# EasyEDA Pro project ProPrj_red-panda-afm_2025-05-21.epro, board PCB5
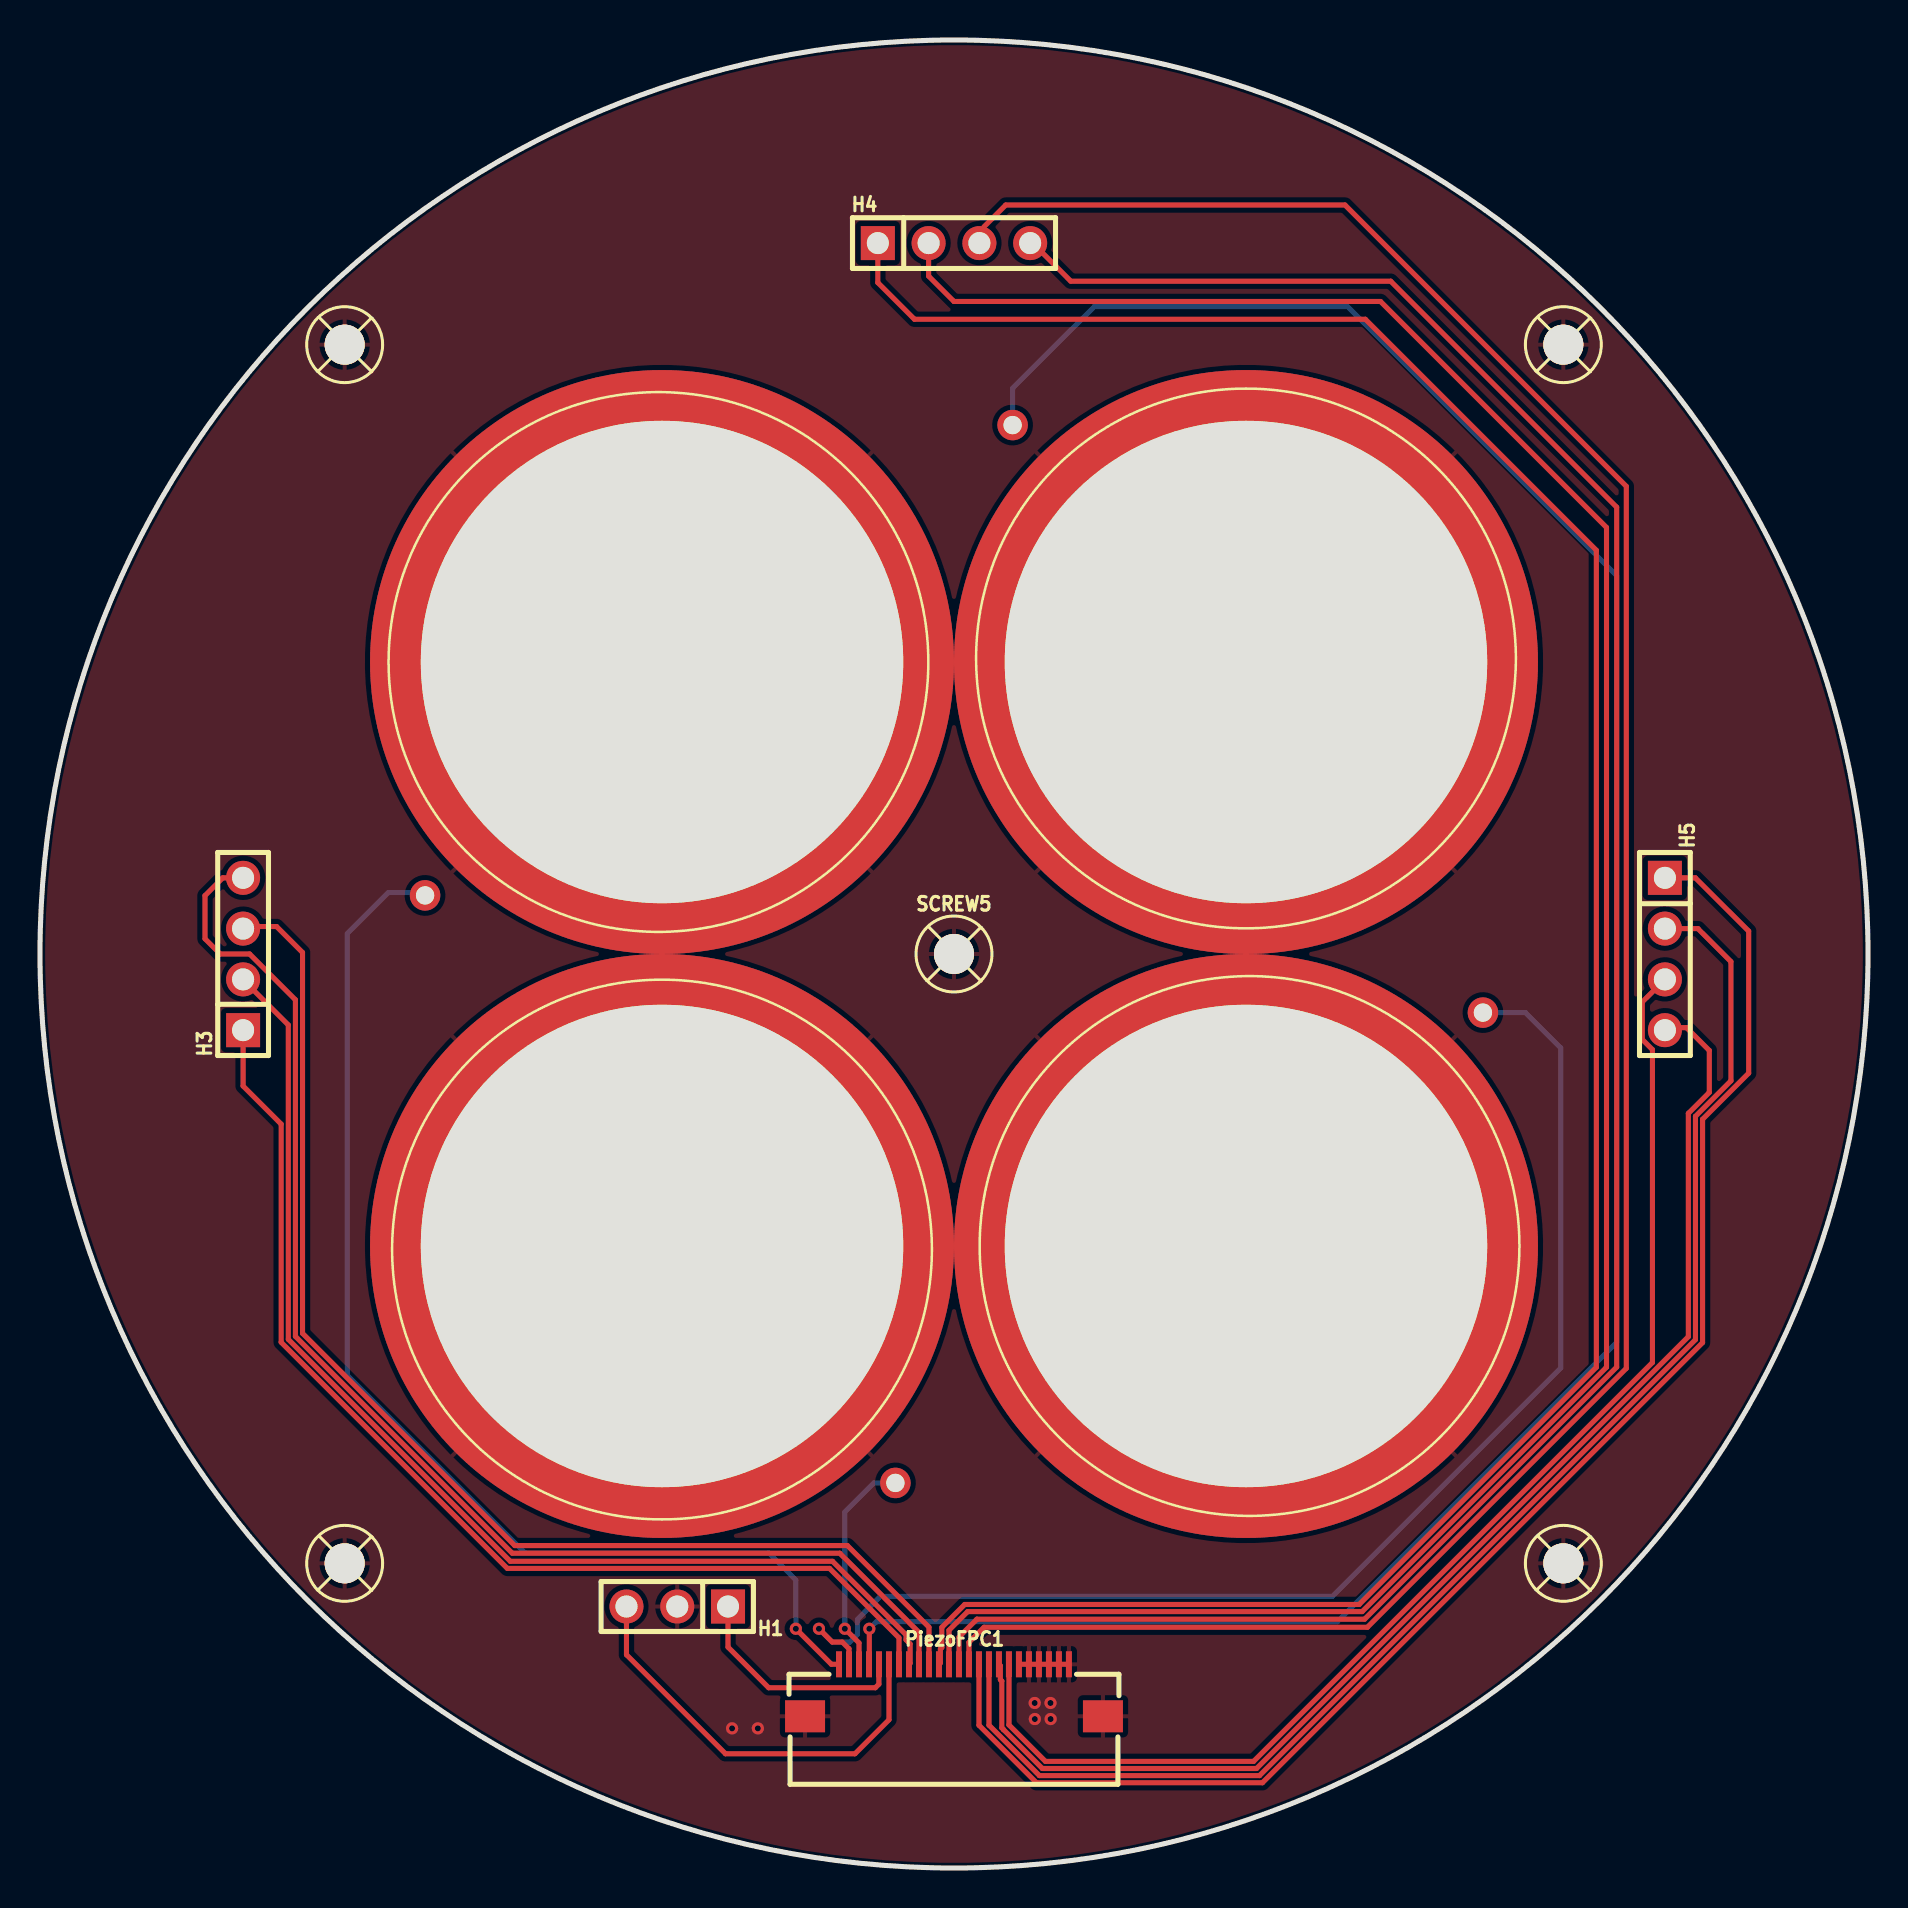
[diagram p10: board, top side]
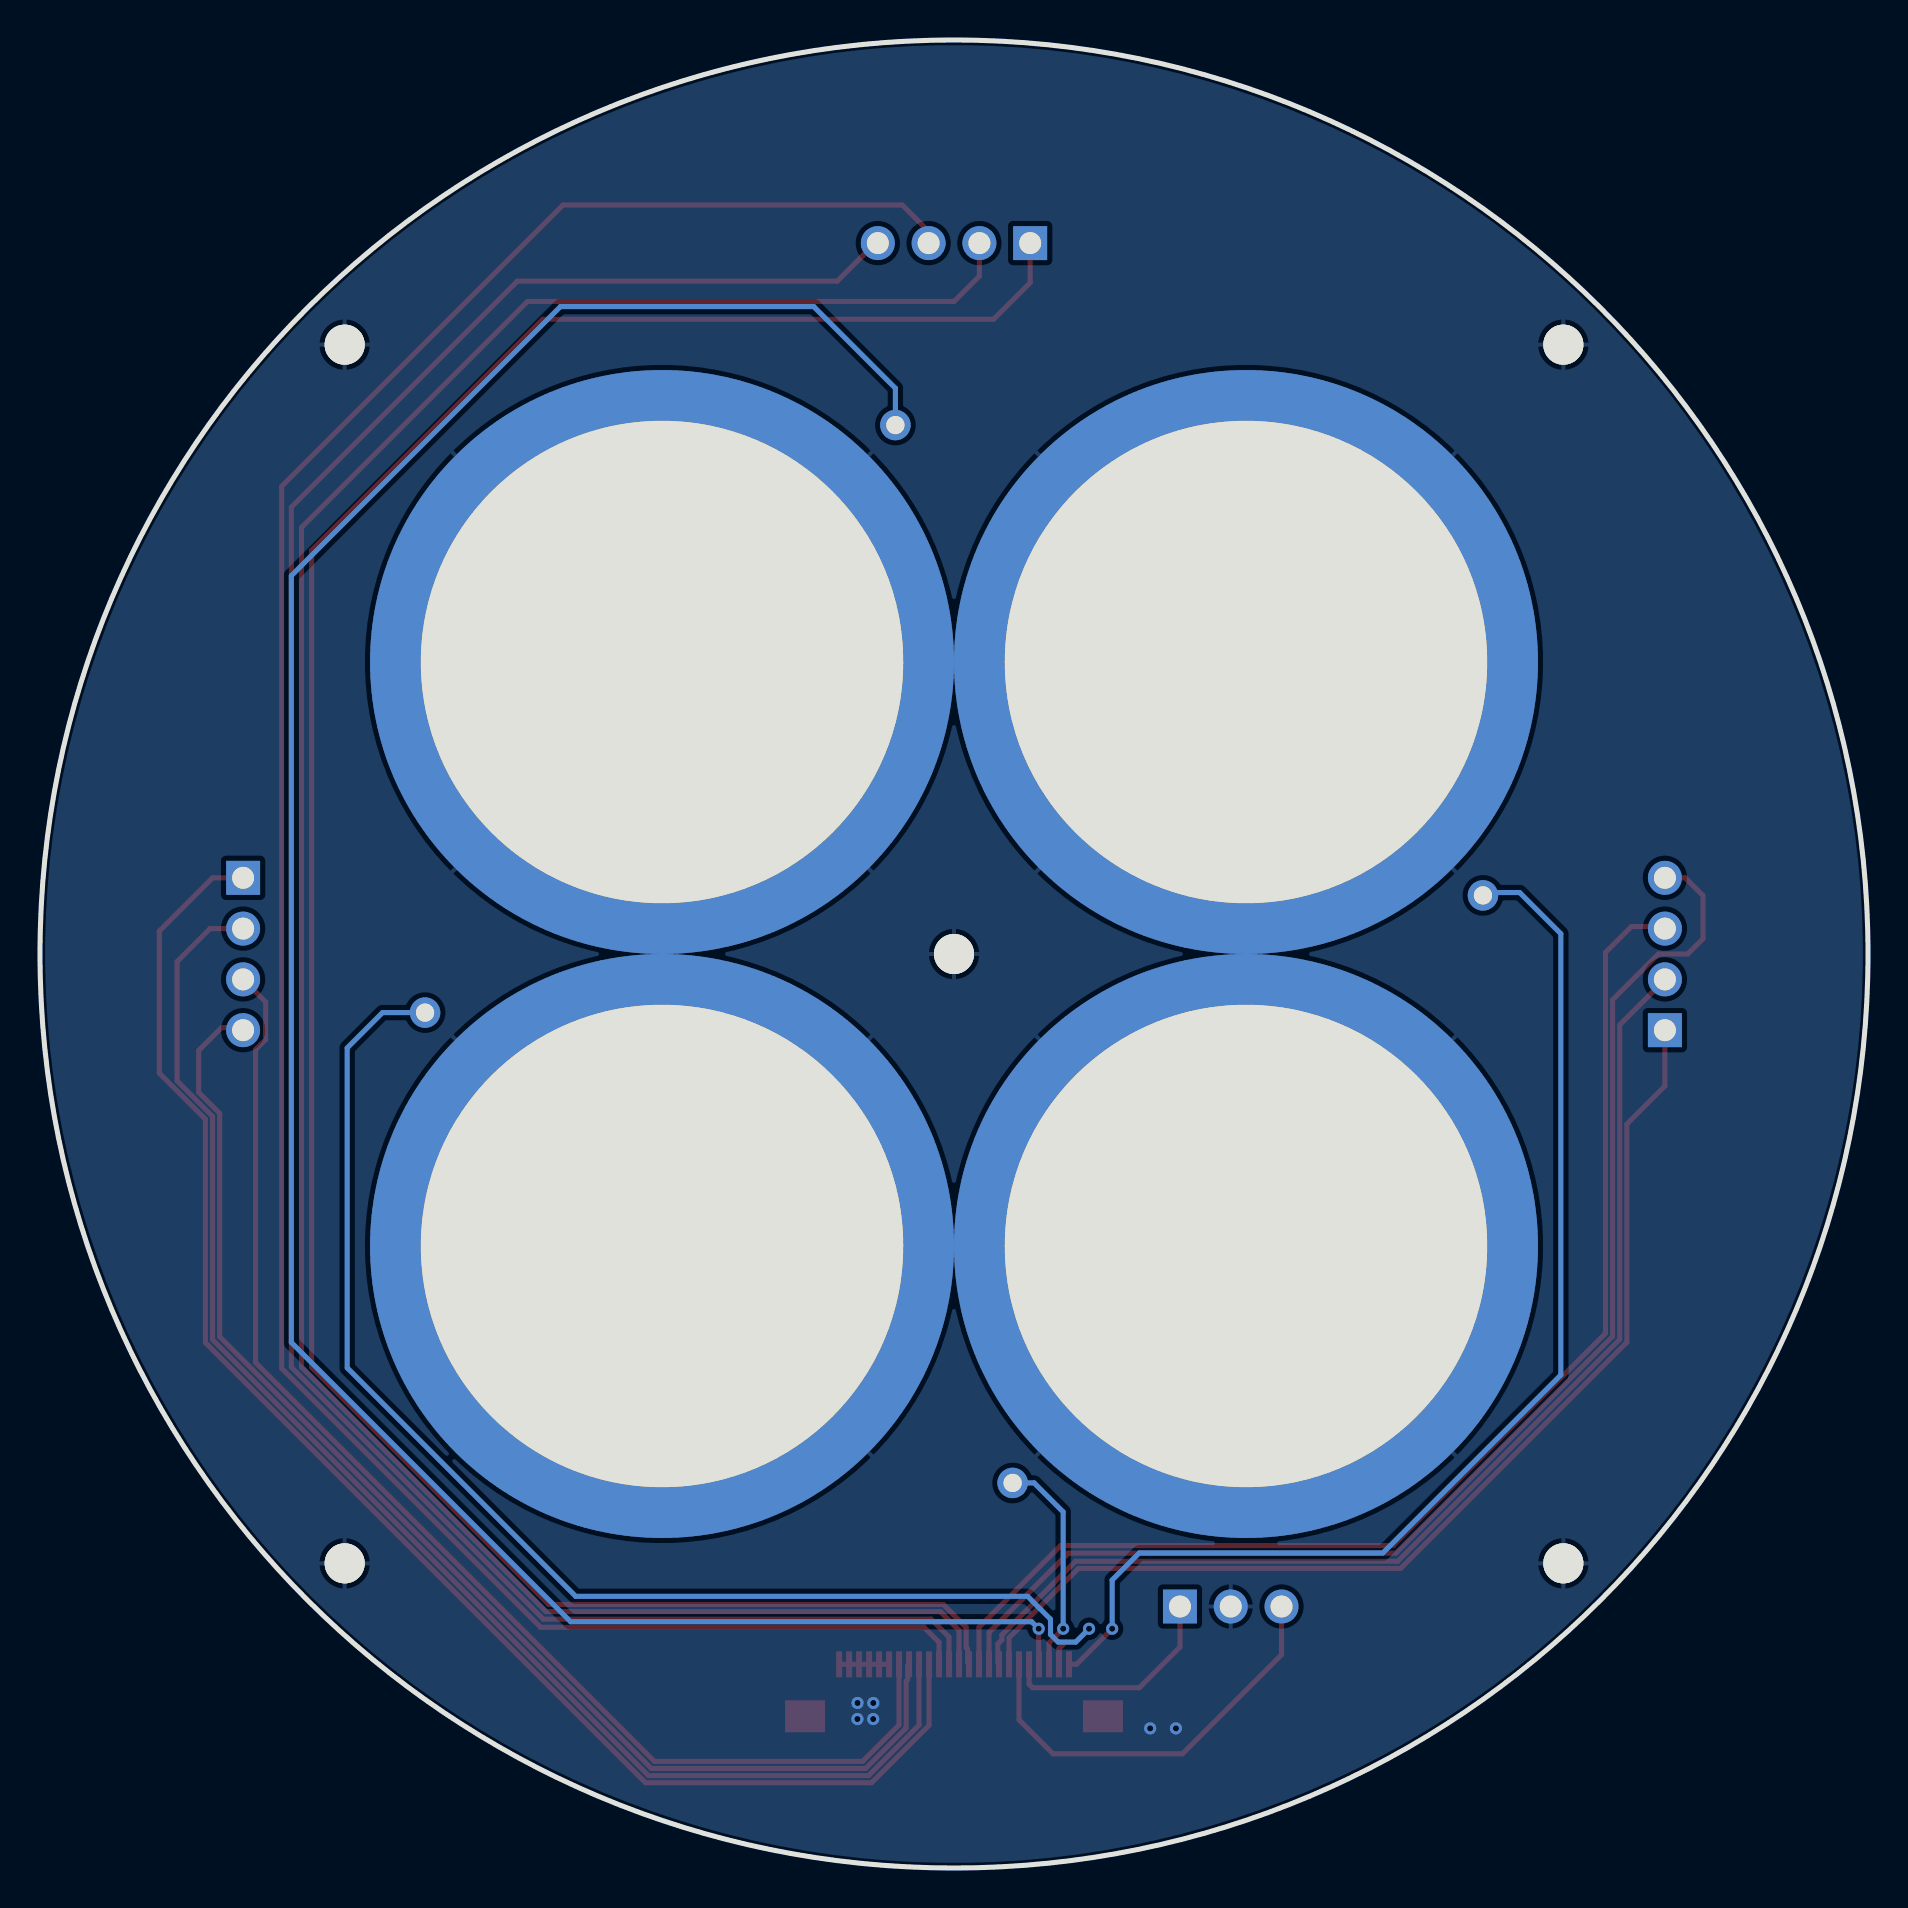
[diagram p11: board, bottom side, seen from below]

Outline 91.44 x 91.44 mm; copper layers: Top Layer, Inner1, Inner2, Bottom Layer. Coordinates in mm from the lower left corner of the outline.
Outline path: circle c45.72,45.72 r45.72
Stack: Top Layer 0.035mm Outer layer thickness 1oz / Dielectric1 0.2104mm 7628 RC49% 8.6mil / Inner1 0.0152mm Inner layer thickness / Dielectric2 1.065mm 1.1mm H/HOZ Copper / Inner2 0.0152mm Inner layer thickness / Dielectric3 0.2104mm 7628 RC49% 8.6mil / Bottom Layer 0.035mm Outer layer thickness 1oz

## Design rules (mm)
template: JLCPCB Capability(Two Layers Board)
spacing copperThickness1oz (default): track to track 0.102, other pairs 0.152 to 0.3
spacing copperThickness2oz: track to track 0.203, other pairs 0.152 to 0.3
track width copperThickness1oz (default): min 0.127, default 0.254, max 2.54
track width copperThickness2oz: min 0.203, default 0.254, max 2.54
differential pair differentialPair (default): width min 0.127, default 0.254, max 2.54; gap min 0.152, default 0.152
via viaSize (default): diameter min 0.5, default 0.61, max 10; hole min 0.3, default 0.305, max 6.3

## Placement (name value [footprint] x y rotation side)
H1  PZ254V-11-03P  [HDR-TH_3P-P2.54-V-M]  31.88 13.08 180 top
H3  PZ254V-11-04P  [HDR-TH_4P-P2.54-V-M]  10.16 45.72 90 top
H4  PZ254V-11-04P  [HDR-TH_4P-P2.54-V-M]  45.72 81.28 0 top
H5  PZ254V-11-04P  [HDR-TH_4P-P2.54-V-M]  81.28 45.72 270 top
PiezoFPC1  AFC01-S24FCA-00  [FPC-SMD_P0.50-24P_FGS-XJ-H2.0]  45.72 8.89 180 top
SCREW1  -  [Screw-Hole-M2]  76.2 76.2 0 top
SCREW2  -  [Screw-Hole-M2]  15.24 76.2 0 top
SCREW3  -  [Screw-Hole-M2]  15.24 15.24 0 top
SCREW4  -  [Screw-Hole-M2]  76.2 15.24 0 top
SCREW5  -  [Screw-Hole-M2]  45.72 45.72 0 top
U1  AB2720B  [XDCR_AB2720B]  60.5 31.11 315 top
U2  AB2720B  [XDCR_AB2720B]  60.33 60.5 45 top
U3  AB2720B  [XDCR_AB2720B]  30.94 60.33 135 top
U4  AB2720B  [XDCR_AB2720B]  31.11 30.94 225 top

## Footprints (pads in the part's own frame, mm; a bottom-side part is the same pattern mirrored in y, then rotated)
FPC-SMD_P0.50-24P_FGS-XJ-H2.0
  rect 0.3x1.3 smd: 1(-5.748,-1.3) 2(-5.248,-1.3) 3(-4.748,-1.3) 4(-4.248,-1.3) 5(-3.748,-1.3) 6(-3.248,-1.3) 7(-2.748,-1.3) 8(-2.248,-1.3) 9(-1.748,-1.3) 10(-1.248,-1.3) 11(-0.748,-1.3) 12(-0.248,-1.3) 13(0.252,-1.3) 14(0.752,-1.3) 15(1.252,-1.3) 16(1.752,-1.3) 17(2.252,-1.3) 18(2.752,-1.3) 19(3.252,-1.3) 20(3.752,-1.3) 21(4.252,-1.3) 22(4.752,-1.3) 23(5.252,-1.3) 24(5.752,-1.3)
  rect 2x1.6 smd: 25(7.45,1.3) 26(-7.45,1.3)
HDR-TH_3P-P2.54-V-M
  rect 1.7x1.7 hole 1.1: 1(-2.54,0)
  round 1.7 hole 1.1: 2(0,0) 3(2.54,0)
HDR-TH_4P-P2.54-V-M
  rect 1.7x1.7 hole 1.1: 1(-3.81,0)
  round 1.7 hole 1.1: 2(-1.27,0) 3(1.27,0) 4(3.81,0)
Screw-Hole-M2
  round 2 hole 2: 1(0,0)
XDCR_AB2720B
  round 1.524 hole 0.914: 1(0,16.51)
  round 29.21 hole 24.13: 2(-0.127,-0.125)

## Nets
As in the schematic.

## Via types
v1: diameter 0.61, hole 0.305, Top Layer to Bottom Layer, 10 vias

## Routing (per net, layer and track width the routed paths; a pad name or vN(x,y) marks a point on that pad's centre or on a via; arc(x,y) is an arc through that point)
GND: length 2.5
  Top Layer w0.254: PiezoFPC1.1 PiezoFPC1.2 PiezoFPC1.3 PiezoFPC1.4 PiezoFPC1.5 PiezoFPC1.6
  vias: v1(34.62,6.98) v1(35.91,6.98) v1(49.76,8.25) v1(49.76,7.45) v1(50.55,8.25) v1(50.55,7.45)
1A0: length 66
  Top Layer w0.254: PiezoFPC1.16 43.97,11.78 40,15.75 23.62,15.75 12.78,26.59 12.78,43.43 10.49,45.72 9.02,45.72 8.25,46.48 8.25,48.64 9.14,49.53 H3.4
1A1: length 117.7
  Top Layer w0.254: 49.53,81.41 51.56,79.38 67.56,79.38 78.87,68.07 78.87,25.06 66.26,12.45 46.86,12.45 45.97,11.56 45.97,10.2 PiezoFPC1.12
1A2: length 64.9
  Top Layer w0.254: H5.4 81.41,42.04 82.36,42.04 83.5,40.89 83.5,38.8 82.45,37.75 82.45,26.58 60.85,4.98 50.14,4.98 48.21,6.91 48.21,6.92 48.11,7.01 48.11,9.35 48.04,9.43 48.04,10.12 PiezoFPC1.8
1B0: length 61.9
  Top Layer w0.254: PiezoFPC1.15 44.47,12.05 40.39,16.13 23.75,16.13 13.13,26.75 13.13,45.8 11.83,47.09 10.26,47.09 H3.3
1B1: length 122.2
  Top Layer w0.254: 47.22,82.1 48.31,83.19 65.28,83.19 79.35,69.11 79.35,24.99 66.4,12.04 47.22,12.04 46.47,11.29 PiezoFPC1.11
1B2: length 64.1
  Top Layer w0.254: PiezoFPC1.7 48.47,7.16 50.29,5.33 60.71,5.33 80.66,25.28 80.66,40.94 80.15,41.44 80.15,43.32 H5.3
2A0: length 59
  Top Layer w0.254: PiezoFPC1.17 43.53,10.25 43.53,11.21 43.32,11.41 43.32,11.66 39.64,15.34 23.52,15.34 12.42,26.45 12.42,42.17 10.14,44.45 ; 10.14,44.45 9.89,44.7 9.53,44.7 9.78,44.45 10.14,44.45 ; 10.14,44.45 H3.2
2A1: length 122.8
  Top Layer w0.254: PiezoFPC1.13 45.47,11.89 46.4,12.83 66.14,12.83 78.36,25.05 78.36,67.06 67.06,78.36 45.72,78.36 44.45,79.63 H4.2
2A2: length 72.1
  Top Layer w0.254: PiezoFPC1.9 47.47,7.15 49.99,4.62 61,4.62 82.81,26.43 82.81,37.6 84.58,39.37 84.58,45.34 82.93,46.99 H5.2
2B0: length 54.8
  Top Layer w0.254: H3.1 10.16,39.12 12.06,37.21 12.06,26.3 23.38,14.99 39.5,14.99 42.97,11.51 PiezoFPC1.18
2B1: length 124.4
  Top Layer w0.254: H4.1 41.91,79.3 43.74,77.47 66.29,77.47 77.85,65.91 77.85,25.05 65.99,13.18 46.26,13.18 45.11,12.04 45.11,11.03 45.04,10.96 45.04,10.26 PiezoFPC1.14
2B2: length 76.4
  Top Layer w0.254: H5.1 82.8,49.53 85.47,46.86 85.47,39.76 83.16,37.45 83.16,26.28 61.15,4.27 49.84,4.27 46.97,7.14 PiezoFPC1.10
-X: length 58.7
  Top Layer w0.254: v1(37.81,11.97) 39.59,10.19 PiezoFPC1.24
  Bottom Layer w0.254: 19.15,48.79 17.42,48.79 15.37,46.74 15.37,24.66 24.27,15.76 36.45,15.76 37.81,14.4 v1(37.81,11.97)
-Y: length 11
  Top Layer w0.254: PiezoFPC1.22 40.97,11.26 v1(40.26,11.97)
  Bottom Layer w0.254: v1(40.26,11.97) 40.26,17.81 41.71,19.26 U4.1
-Z: length 11.1
  Top Layer w0.254: PiezoFPC1.20 41.96,10.19 41.96,9.2 41.78,9.02 36.45,9.02 34.42,11.05 34.42,12.7
X: length 66.8
  Top Layer w0.254: v1(38.96,11.97) 39.63,11.3 40.13,11.3 40.47,10.97 PiezoFPC1.23
  Bottom Layer w0.254: U1.1 74.31,42.79 76.07,41.02 76.07,25.02 64.64,13.59 42.04,13.59 40.89,12.45 40.89,11.68 40.51,11.3 39.63,11.3 v1(38.96,11.97)
Y: length 122.8
  Top Layer w0.254: PiezoFPC1.21 41.48,10.21 v1(41.48,11.97)
  Bottom Layer w0.254: v1(41.48,11.97) 41.83,12.32 64.9,12.32 78.87,26.29 78.87,64.64 65.41,78.11 52.74,78.11 48.65,74.02 U2.1
Z: length 20.7
  Top Layer w0.254: 29.34,12.7 29.34,10.67 34.29,5.72 40.77,5.72 42.47,7.42 PiezoFPC1.19

## Copper pours and planes (outline as drawn; the poured copper is in the pictures)
GND on Top Layer: -33.27,117.6 120.4,117.6 120.4,-35.31 -33.27,-35.31
GND on Bottom Layer: -31.75,117.73 126.75,117.73 126.75,-22.99 -31.75,-22.99
